# EAGLE design TPS61022_Breakout (EAGLE 9.6.2)
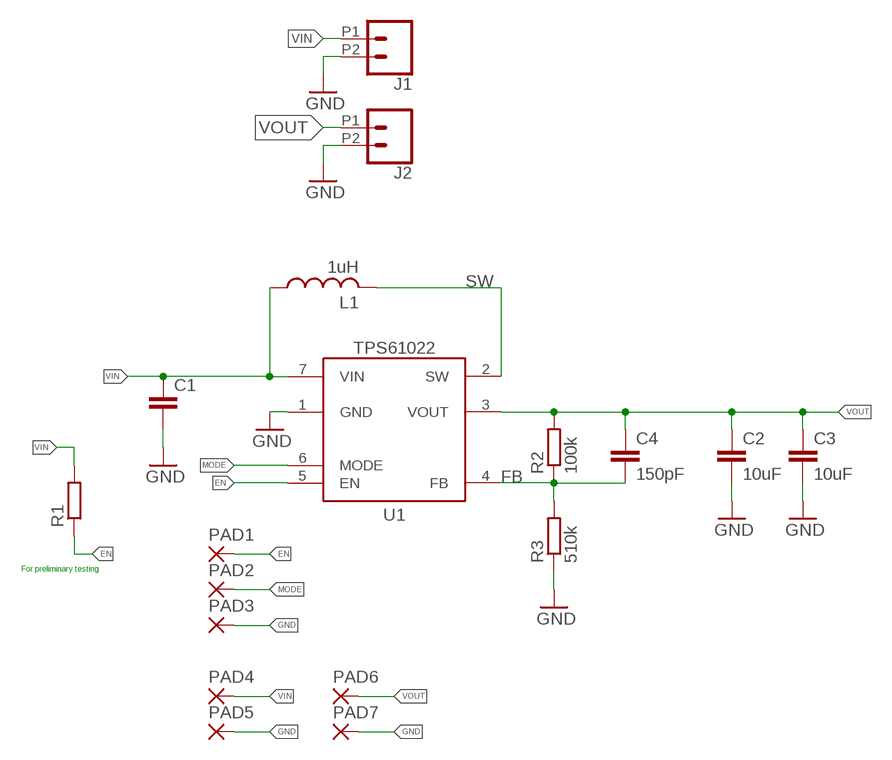
[diagram p0: schematic, sheet 1]

## Parts
C1  C-EUC0805  [C0805]
C2  10uF  C-EU10UFC0805  [C0805]
C3  10uF  C-EU10UFC0805  [C0805]
C4  150pF  C-EUC0603  [C0603]
J1  CONN_022.54_SCREW_ROUND  [1X02_2.54_SCREWTERM_ROUND]
J2  CONN_022.54_SCREW_ROUND  [1X02_2.54_SCREWTERM_ROUND]
L1  1uH  INDUCTOR_HCI_5040  [WE-HCI(5040)]
PAD1  SMD2  [SMD1,27-2,54]
PAD2  SMD2  [SMD1,27-2,54]
PAD3  SMD2  [SMD1,27-2,54]
PAD4  SMD5  [SMD2,54-5,08]
PAD5  SMD5  [SMD2,54-5,08]
PAD6  SMD5  [SMD2,54-5,08]
PAD7  SMD5  [SMD2,54-5,08]
R1  R-EU_100KR0603  [R0603]
R2  100k  R-EU_100KR0603  [R0603]
R3  510k  R-EU_R0603  [R0603]
U1  TPS61022  [RWU0007A]

## Nets
EN: PAD1.1(P) R1.1 U1.5(EN)
FB: C4.2 R2.1 R3.2 U1.4(FB)
GND: C1.2 C2.2 C3.2 J1.P2 J2.P2 PAD3.1(P) PAD5.1(P) PAD7.1(P) R3.1 U1.1(GND)
MODE: PAD2.1(P) U1.6(MODE)
SW: L1.P$2 U1.2(SW)
VIN: C1.1 J1.P1 L1.P$1 PAD4.1(P) R1.2 U1.7(VIN)
VOUT: C2.1 C3.1 C4.1 J2.P1 PAD6.1(P) R2.2 U1.3(VOUT)

## Notes on the sheet
- For preliminary testing

## Library data of the parts
C1 C4 = bschulz_passives:C-EU: CAPACITOR, European symbol
C2 C3 = bschulz_passives:C-EU: CAPACITOR, European symbol; DIGIKEY: 490-6473-1-ND; MF: Murata; MPN: GRM21BR61C106KE15K
J1 J2 = bschulz:CONN_02: Genaric 2 terminal header SCREW_2.54 <https://www.digikey.com/product-detail/en/on-shore-technology-inc/OSTVN02A150/ED10561-ND/1588862> 39532_RA <https://www.digikey.com/product-detail/en/molex/0395321002/WM7845-ND/1280696>; DIGIKEY: ED10561-ND; MF: OnShore; MPN: OSTVN02A150
L1 = bschulz:INDUCTOR: Genaric inductor
PAD1-PAD3 = bschulz:SMD2: SMD PAD; DIGIKEY: N/A; MF: N/A; MPN: DNP
PAD4-PAD7 = wirepad:SMD5: SMD PAD
R1 R2 = bschulz_passives:R-EU_: RESISTOR, European symbol Digikey Parts: Yageo, 0402 <https://www.digikey.com/products/en/resistors/chip-resistor-surface-mount/52?k=&pkeyword=&sv=0&s=4356&sf=1&FV=-1%7C13%2C7%7C2%2C1291%7C39157%2C1989%7C0%2C-8%7C52%2C3%7C1131%2C3%7C2503&quantity=&ColumnSort=0&page=1&stock=1&pageSize=25> Yageo, 0603 <https://www.digikey.com/products/en/resistors/chip-resistor-surface-mount/52?k=&pkeyword=&sv=0&pv1291=39245&sf=1&FV=-5%7C4356%2C-5%7C47360%2C-8%7C52%2C-1%7C13%2C7%7C2%2C1989%7C0&quantity=10&ColumnSort=1000011&page=1&stock=1&pageSize=25> Panasonic, 0603 <https://www.digikey.com/products/en/resistors/chip-resistor-surface-mount/52?k=&pkeyword=&pv252=68&sf=0&FV=ffec373d%2C1c0002%2C142c040c%2C1f140000%2Cffe00034%2C80002%2Cc0001&quantity=&ColumnSort=0&page=1&stock=1&pageSize=25> Panasonic, precision, 0603 <https://www.digikey.com/products/en/resistors/chip-resistor-surface-mount/52?FV=ffec4907%2Cfffc000a%2Cc0172%2C142c040c%2C1f140000%2Cffe00034%2C1c0002&quantity=100&ColumnSort=2085&page=1&stock=1&pageSize=25> Panasonic, 0805 <https://www.digikey.com/products/en/resistors/chip-resistor-surface-mount/52?k=&pkeyword=&pv3=1&sf=0&FV=ffec373d%2C1c0002%2C1f140000%2Cffe00034%2C142c040d&quantity=&ColumnSort=0&page=1&stock=1&pageSize=25> Rohm, current sense <https://www.digikey.com/products/en/resistors/chip-resistor-surface-mount/52?k=&pkeyword=&pv3=1&sf=0&FV=ffecb688%2C1f140000%2Cffe00034%2C1c0002&quantity=&ColumnSort=0&page=1&stock=1&pageSize=25> Vishay, pulse proof automotive <https://www.digikey.com/products/en/resistors/chip-resistor-surface-mount/52?k=&pkeyword=&pv7=2&sf=0&FV=ffec5d6b%2Cffe00034%2C1f140000&quantity=&ColumnSort=0&page=1&stock=1&pageSize=25>; DIGIKEY: 311-100KHRCT-ND; MF: Yageo; MPN: RC0603FR-07100KL; VALUE_PART: 100k
R3 = bschulz_passives:R-EU_: RESISTOR, European symbol Digikey Parts: Yageo, 0402 <https://www.digikey.com/products/en/resistors/chip-resistor-surface-mount/52?k=&pkeyword=&sv=0&s=4356&sf=1&FV=-1%7C13%2C7%7C2%2C1291%7C39157%2C1989%7C0%2C-8%7C52%2C3%7C1131%2C3%7C2503&quantity=&ColumnSort=0&page=1&stock=1&pageSize=25> Yageo, 0603 <https://www.digikey.com/products/en/resistors/chip-resistor-surface-mount/52?k=&pkeyword=&sv=0&pv1291=39245&sf=1&FV=-5%7C4356%2C-5%7C47360%2C-8%7C52%2C-1%7C13%2C7%7C2%2C1989%7C0&quantity=10&ColumnSort=1000011&page=1&stock=1&pageSize=25> Panasonic, 0603 <https://www.digikey.com/products/en/resistors/chip-resistor-surface-mount/52?k=&pkeyword=&pv252=68&sf=0&FV=ffec373d%2C1c0002%2C142c040c%2C1f140000%2Cffe00034%2C80002%2Cc0001&quantity=&ColumnSort=0&page=1&stock=1&pageSize=25> Panasonic, precision, 0603 <https://www.digikey.com/products/en/resistors/chip-resistor-surface-mount/52?FV=ffec4907%2Cfffc000a%2Cc0172%2C142c040c%2C1f140000%2Cffe00034%2C1c0002&quantity=100&ColumnSort=2085&page=1&stock=1&pageSize=25> Panasonic, 0805 <https://www.digikey.com/products/en/resistors/chip-resistor-surface-mount/52?k=&pkeyword=&pv3=1&sf=0&FV=ffec373d%2C1c0002%2C1f140000%2Cffe00034%2C142c040d&quantity=&ColumnSort=0&page=1&stock=1&pageSize=25> Rohm, current sense <https://www.digikey.com/products/en/resistors/chip-resistor-surface-mount/52?k=&pkeyword=&pv3=1&sf=0&FV=ffecb688%2C1f140000%2Cffe00034%2C1c0002&quantity=&ColumnSort=0&page=1&stock=1&pageSize=25> Vishay, pulse proof automotive <https://www.digikey.com/products/en/resistors/chip-resistor-surface-mount/52?k=&pkeyword=&pv7=2&sf=0&FV=ffec5d6b%2Cffe00034%2C1f140000&quantity=&ColumnSort=0&page=1&stock=1&pageSize=25>; MF: Yageo
U1 = bschulz:TPS61022: TPS61022 - Boost converter with ultra-low input voltage Characteristics: Vin: 0.5V ~ 5.5V Vout: 2.2V ~ 5.5V Output Current (max): 8A IQ: 27μA (typ) Operating Temperature: -40°C to 85°C Digikey: 296-TPS61022RWUTCT-ND <https://www.digikey.com/en/products/detail/texas-instruments/TPS61022RWUT/10434643>; DIGIKEY: 296-TPS61022RWUTCT-ND; MF: TI; MPN: TPS61022RWUT

## Board
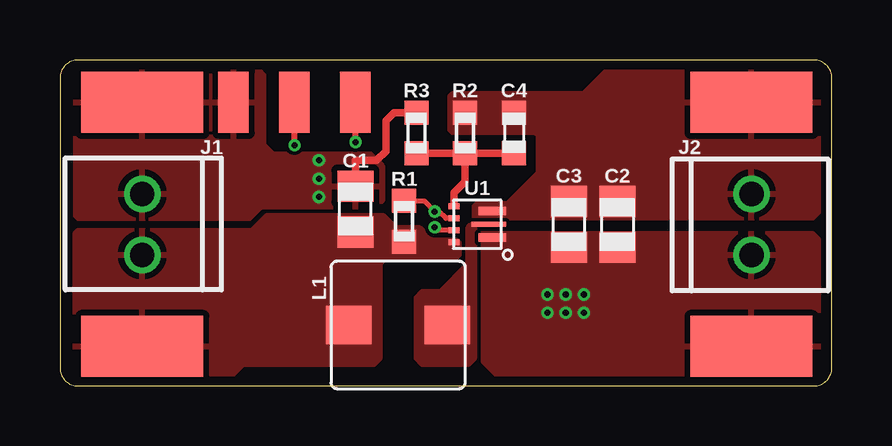
[diagram p1: board, top side]
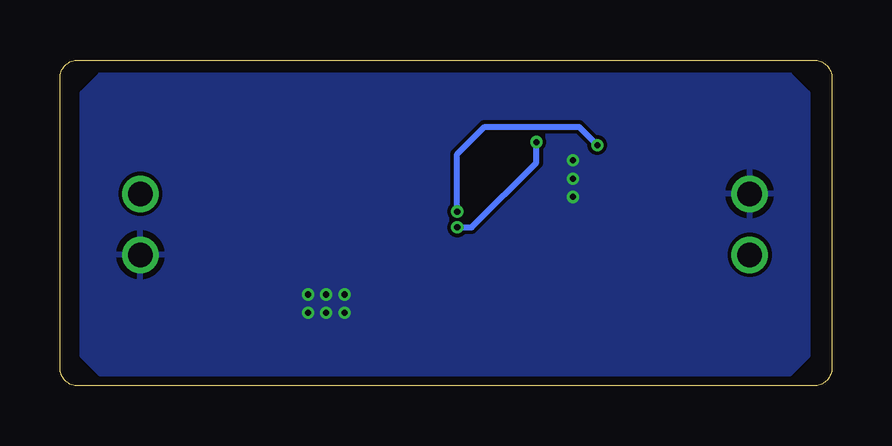
[diagram p2: board, bottom side, seen from below]

Size 32.18 x 13.58 mm. Coordinates in mm from the lower left corner, seen from the top.
Outline: 31.43,13.58 0.75,13.58 arc90 0,12.83 0,0.75 arc90 0.75,0 31.43,0 arc90 32.18,0.75 32.18,12.83 arc90 31.43,13.58
Copper layers (1*16): Top 0.035559375mm / dielectric 1.6mm / Bottom 0.035559375mm
Design rules "oshpark-2layer": minimum track width 6mil, minimum drill 10mil, track to track 6mil, track to pad 6mil, pad to pad 6mil, via to via 6mil, smd to smd 6mil, copper to edge 15mil, drill to drill 6mil, minimum pad ring 5mil, minimum via ring 5mil, stop-mask expansion 2.5mil, vias tented up to drill 0mil, thermal gap 10mil

### Footprints (pad centres in the part's own frame; a part is rotated, then mirrored left to right if it is on the bottom)
C0805 = smd 1.3 x 1.5: 1 -0.95,0; 2 0.95,0
C0603 = smd 1 x 1: 1 -0.85,0; 2 0.85,0
1X02_2.54_SCREWTERM_ROUND = drill 1.016: P1 1.27,0; P2 -1.27,0
WE-HCI(5040) = smd 1.9 x 1.6: P$1 -2.05,0; P$2 2.05,0
SMD1,27-2,54 = smd 1.27 x 2.54: 1 0,0
SMD2,54-5,08 = smd 2.54 x 5.08: 1 0,0
R0603 = smd 1 x 1: 1 -0.85,0; 2 0.85,0
RWU0007A = smd 1.15 x 0.35: 1 -0.625,0.55; 3 -0.625,-0.55 | smd 1.45 x 0.2: 2 -0.475,0 | smd 0.45 x 0.25: 4 0.975,-0.75; 5 0.975,-0.25; 6 0.975,0.25; 7 0.975,0.75

### Placement (x,y rotation side)
C1  12.32,7.37 90 top
C2  23.24,6.73 270 top
C3  21.21,6.73 270 top
C4  18.92,10.54 270 top
J1  3.43,6.73 270 top
J2  28.83,6.73 90 top
L1  14.1,2.54 0 top
PAD1  9.78,11.81 180 top
PAD2  12.32,11.81 180 top
PAD3  7.24,11.81 180 top
PAD4  3.43,1.65 90 top
PAD5  3.43,11.81 90 top
PAD6  28.83,11.81 90 top
PAD7  28.83,1.65 90 top
R1  14.35,6.86 270 top
R2  16.89,10.54 90 top
R3  14.86,10.54 270 top
U1  17.4,6.73 180 top

### Tracks (layer width: path | path; a pad name or v marks a point on that pad's centre or on a via)
EN  (via drill 0.25)
  Top 0.2: R1.1 15.18,7.71 v15.62,7.26 15.81,7.26 16.09,6.98 U1.5
  Top 0.254: v9.78,10.03 PAD1.1
  Bottom 0.254: v15.62,7.26 15.62,9.65 14.48,10.79 10.54,10.79 v9.78,10.03
FB
  Top 0.305: U1.4 16.42,8.04 16.89,8.51 R2.1 | R3.2 R2.1 | R2.1 C4.2
GND  (via drill 0.25)
  Top 0.305: C1.2 12.32,9.4 13.21,9.4 13.59,9.78 13.59,11.05 13.93,11.39 R3.1
  other vias: 10.79,9.4 10.79,8.64 10.79,7.87 20.32,3.81 20.32,3.05 21.08,3.81 21.08,3.05 21.84,3.05 21.84,3.81
  pour Top (rank 2, no thermals): 17.53,6.35 25.78,6.35 25.78,0.25 18.41,0.25 17.65,1.02 17.65,5.84 17.53,5.97
  pour Top (rank 2): 25.78,6.35 31.37,6.35 31.62,6.1 31.62,0.25 31.5,0.13 26.16,0.13 25.78,0.51
  pour Top (rank 3): 0.64,13.08 0.64,7.11 0.76,6.99 8.13,6.99 8.51,7.37 13.08,7.37 13.46,7.75 13.46,9.14 12.95,9.65 8.89,9.65 8.51,10.03 8.51,12.95 8.26,13.21 0.76,13.21
  pour Bottom (rank 3): 1.02,11.56 1.02,1.26 1.77,0.51 30.49,0.51 31.24,1.26 31.24,12.2 30.49,12.95 1.77,12.95 1.02,12.2
MODE  (via drill 0.25)
  Top 0.2: U1.6 15.74,6.48 v15.62,6.6
  Top 0.254: v12.32,10.16 PAD2.1
  Bottom 0.254: v15.62,6.6 15.02,6.6 12.32,9.3 v12.32,10.16
SW
  pour Top (no thermals): 17.02,6.6 17.14,6.73 17.27,6.73 17.27,1.14 17.02,0.89 15.11,0.89 14.86,1.14 14.86,3.68 15.11,3.94 15.88,3.94 17.02,5.08
VIN
  pour Top (rank 2, no thermals): 16.64,5.97 16.64,5.46 16.51,5.33 13.59,5.33 13.34,5.08 13.34,1.14 13.08,0.89 10.79,0.89 10.79,7.11 13.46,7.11 13.97,6.6 14.99,6.6 15.49,6.1 16.51,6.1
  pour Top (rank 2): 10.79,0.89 7.62,0.89 7.11,0.38 0.64,0.38 0.64,6.35 0.76,6.48 8,6.48 8.64,7.11 10.79,7.11
VOUT
  pour Top (rank 2, no thermals): 17.27,7.49 17.4,7.62 18.67,7.62 19.94,8.89 19.94,10.41 19.81,10.54 16.38,10.54 16.26,10.67 16.26,12.06 16.38,12.19 21.84,12.19 22.99,13.34 25.91,13.34 25.91,6.99 17.27,6.99
  pour Top (rank 2): 25.91,13.34 31.5,13.34 31.62,13.21 31.62,7.24 31.37,6.99 25.91,6.99

### Text on the board
tDocu: Break44 | GND | EN | MODE | - | + | + | - | Input | Output | TPS61022 Breakout / v0.0 / B. Schulz